# Altium schematic sheet ADC_DAC.SchDoc
size A3; DocumentNumber: 6; SheetNumber: 5; SheetTotal: 6
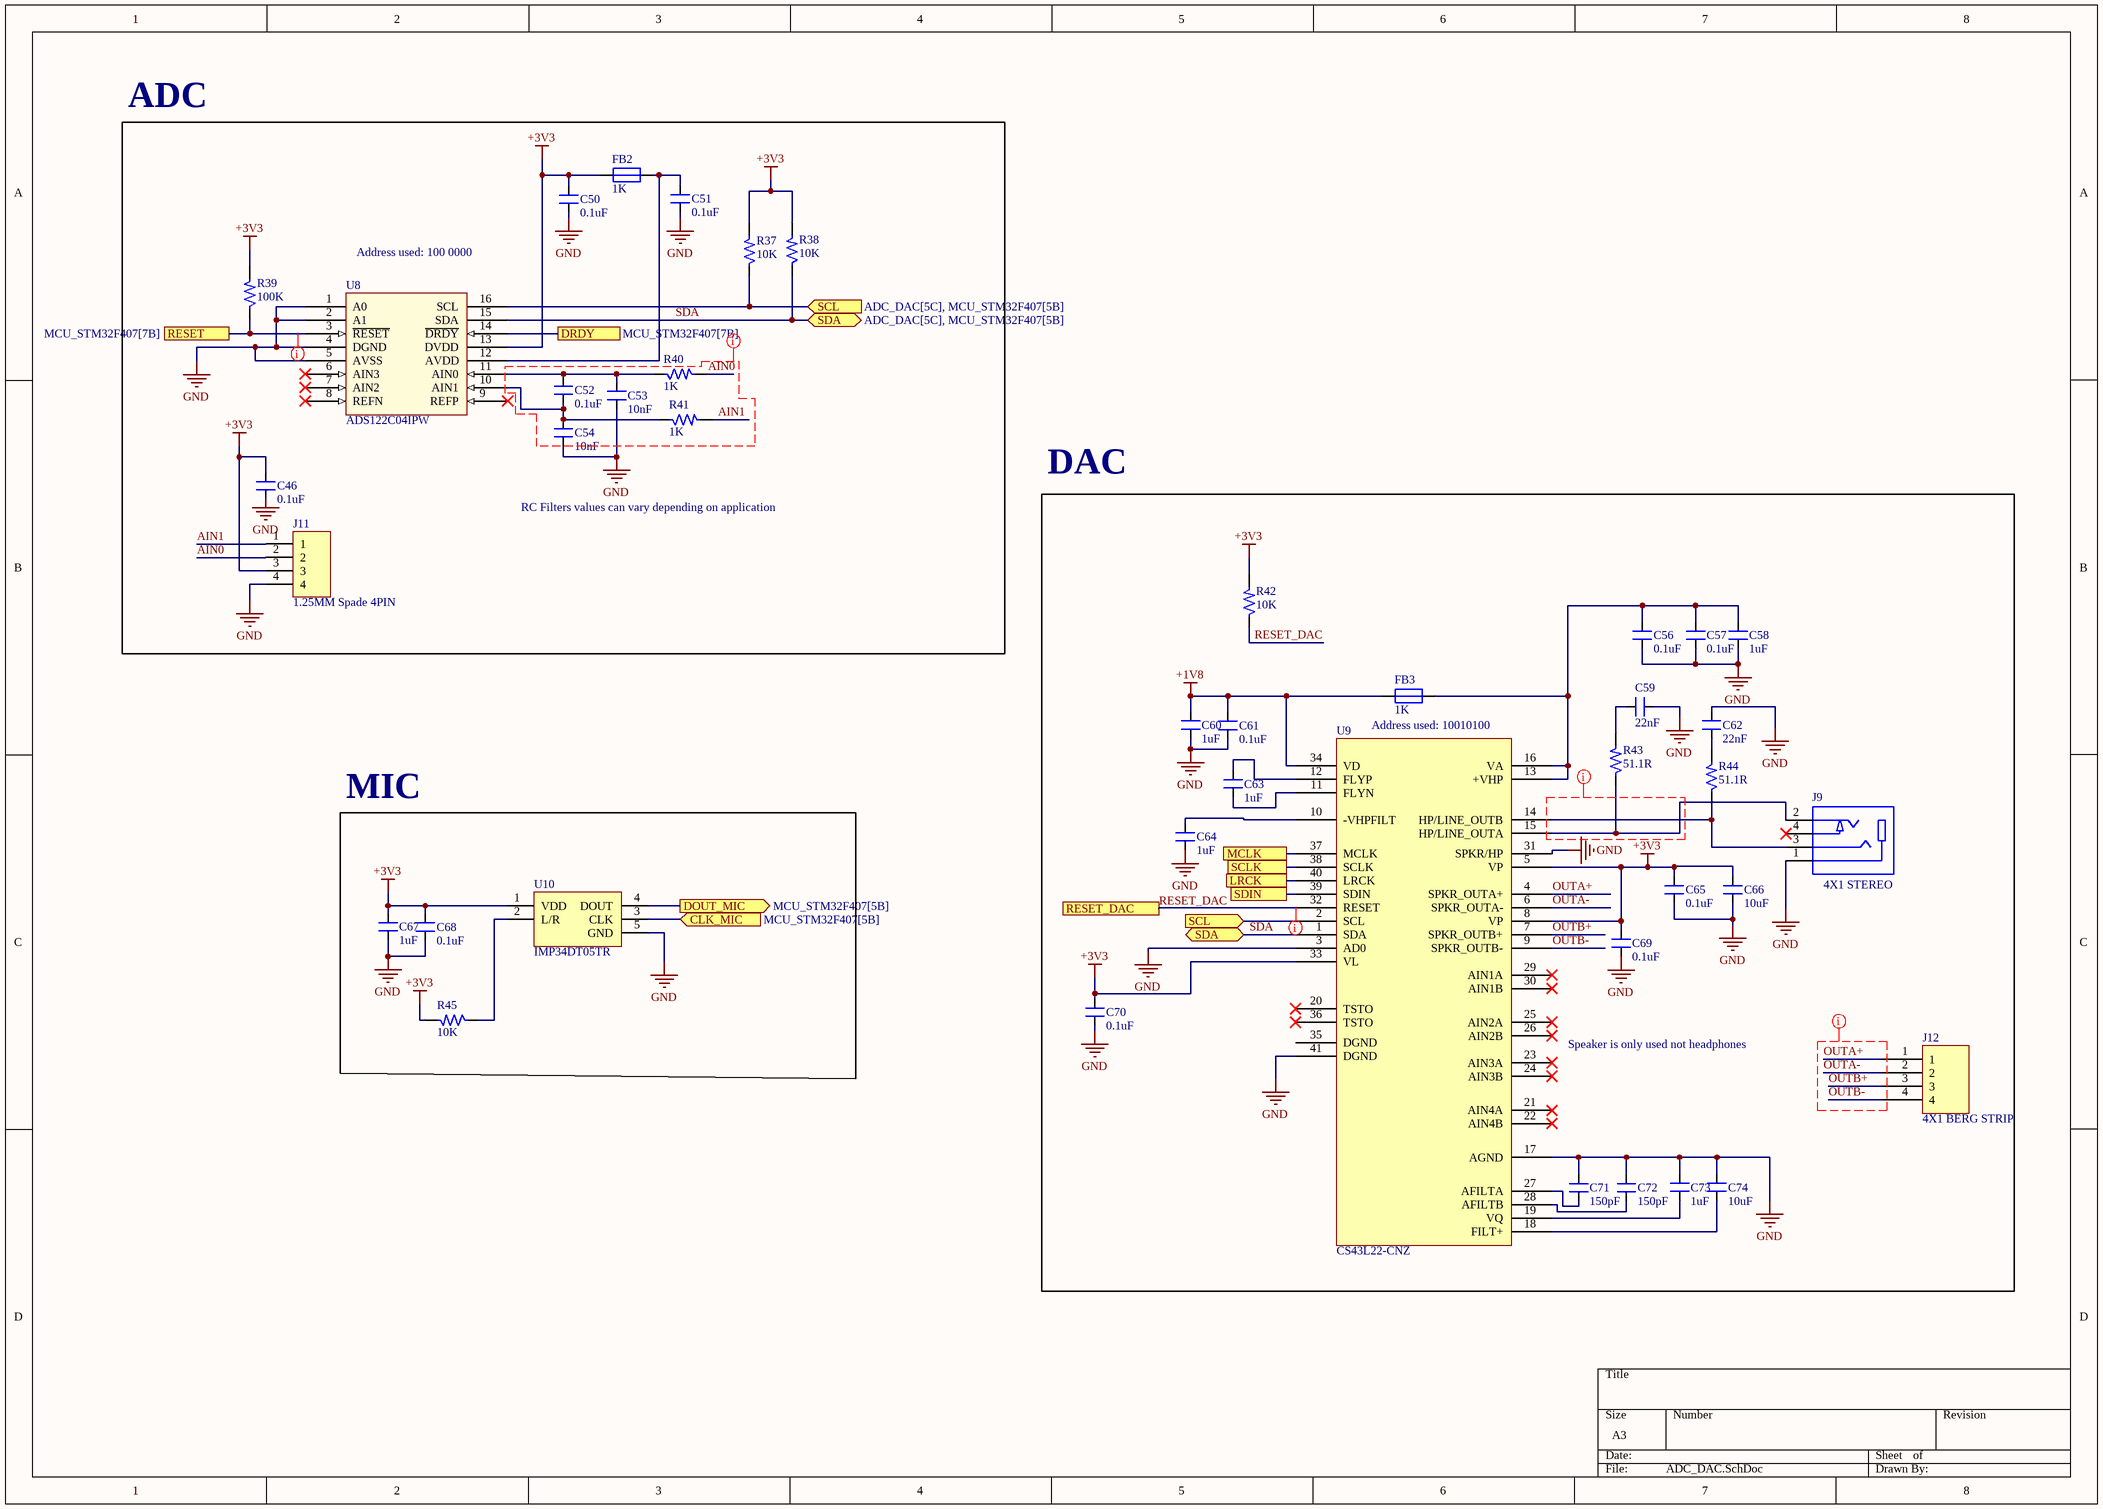
[diagram p0: ADC_DAC.SchDoc]

## Parts
C46  0.1uF  [CAP_0805]
C50  0.1uF  [CAP_0805]
C51  0.1uF  [CAP_0805]
C52  0.1uF  [CAP_0805]
C53  10nF  [CAP_0805]
C54  10nF  [CAP_0805]
C56  0.1uF  [CAP_0805]
C57  0.1uF  [CAP_0805]
C58  1uF  [CAP_0805]
C59  22nF  [CAP_0805]
C60  1uF  [CAP_0805]
C61  0.1uF  [CAP_0805]
C62  22nF  [CAP_0805]
C63  1uF  [CAP_0805]
C64  1uF  [CAP_0805]
C65  0.1uF  [CAP_0805]
C66  10uF  [CAP_1206]
C67  1uF  [CAP_0805]
C68  0.1uF  [CAP_0805]
C69  0.1uF  [CAP_0805]
C70  0.1uF  [CAP_0805]
C71  150pF  [CAP_0805]
C72  150pF  [CAP_0805]
C73  1uF  [CAP_0805]
C74  10uF  [CAP_1206]
FB2  1K  [IND_0805]
FB3  1K  [IND_0805]
J9  4X1 STEREO  [CON_SJ-2504A-SMT-TR_SMD]
J11  1.25MM Spade 4PIN  [CON4_50_653004117322_TH_RA]
J12  4X1 BERG STRIP  [CON4_100_40D72_TH_ST_MALE]
R37  10K  [RES_0603]
R38  10K  [RES_0603]
R39  100K  [RES_0603]
R40  1K  [RES_0603]
R41  1K  [RES_0603]
R42  10K  [RES_0603]
R43  51.1R  [RES_0603]
R44  51.1R  [RES_0603]
R45  10K  [RES_0603]
U8  ADS122C04IPW  [TSSOP16_25-59_294_54X14_SMT]
U9  CS43L22-CNZ  [QFN40_19_284_33X9_SMD]
U10  IMP34DT05TR  [HCLGA-4_53_137_15X37_SMD]

## Blocks framed on the sheet
ADC: C46 C50-C54 FB2 J11 R37-R41 U8
DAC: C56-C66 C69-C74 FB3 J9 J12 R42-R44 U9

## Ports
CLK_MIC (in, see MCU_STM32F407[5B]), DOUT_MIC (out, see MCU_STM32F407[5B]), DRDY (see MCU_STM32F407[7B]), LRCK (see MCU_STM32F407[5B]), MCLK, RESET (see MCU_STM32F407[7B]), RESET_DAC (see MCU_STM32F407[5B]), SCL (in, see ADC_DAC[4A], MCU_STM32F407[5B]), SCL (in, see ADC_DAC[5C], MCU_STM32F407[5B]), SCLK (see MCU_STM32F407[5B]), SDA (bidir, see ADC_DAC[4A], MCU_STM32F407[5B]), SDA (bidir, see ADC_DAC[5C], MCU_STM32F407[5B]), SDIN (see MCU_STM32F407[5B])

## Nets
+1V8: C60.2 C61.2 FB3.1 U9.34(VD)
+3V3: C46.2 C50.2 C65.2 C66.2 C67.2 C68.2 C69.2 C70.2 FB2.1 J11.3 R37.2 R38.2 R39.2 R42.2 R45.2 U8.13(DVDD) U9.5(VP) U9.8(VP) U9.33(VL) U10.1(VDD)
GND: C46.1 C50.1 C51.1 C53.2 C54.2 C56.1 C57.1 C58.1 C59.1 C60.1 C61.1 C62.2 C64.1 C65.1 C66.1 C67.1 C68.1 C69.1 C70.1 C71.2 C72.2 C73.2 C74.2 J9.1 J11.4 U8.1(A0) U8.2(A1) U8.4(DGND) U8.5(AVSS) U9.3(AD0) U9.17(AGND) U9.31(SPKR/HP) U9.41(DGND) U10.5(GND)
AIN0: J11.2 R40.2
AIN1: J11.1 R41.2
CLK_MIC: U10.3(CLK) ; port CLK_MIC
DOUT_MIC: U10.4(DOUT) ; port DOUT_MIC
DRDY: U8.14(~{DRDY}) ; port DRDY
LRCK: U9.40(LRCK) ; port LRCK
MCLK: U9.37(MCLK) ; port MCLK
OUTA+: J12.1 U9.4(SPKR_OUTA+)
OUTA-: J12.2 U9.6(SPKR_OUTA-)
OUTB+: J12.3 U9.7(SPKR_OUTB+)
OUTB-: J12.4 U9.9(SPKR_OUTB-)
RESET: R39.1 U8.3(~{RESET}) ; port RESET
RESET_DAC: R42.1 U9.32(RESET) ; port RESET_DAC
SCL: R37.1 U8.16(SCL) U9.2(SCL) ; port SCL
SCLK: U9.38(SCLK) ; port SCLK
SDA: R38.1 U8.15(SDA) U9.1(SDA) ; port SDA
SDIN: U9.39(SDIN) ; port SDIN
NetC51_2: C51.2 FB2.2 U8.12(AVDD)
NetC52_1: C52.1 C54.1 R41.1 U8.10(AIN1)
NetC52_2: C52.2 C53.1 R40.1 U8.11(AIN0)
NetC56_2: C56.2 C57.2 C58.2 FB3.2 U9.13(+VHP) U9.16(VA)
NetC59_2: C59.2 R43.2
NetC62_1: C62.1 R44.2
NetC63_1: C63.1 U9.11(FLYN)
NetC63_2: C63.2 U9.12(FLYP)
NetC64_2: C64.2 U9.10(-VHPFILT)
NetC71_1: C71.1 U9.27(AFILTA)
NetC72_1: C72.1 U9.28(AFILTB)
NetC73_1: C73.1 U9.19(VQ)
NetC74_1: C74.1 U9.18(FILT+)
NetJ9_2: J9.2 J9.3 R43.1 R44.1 U9.14(HP/LINE_OUTB) U9.15(HP/LINE_OUTA)
NetR45_1: R45.1 U10.2(L/R)

Not connected (* = marked no-connect by the designer): J9 4*; U8 6(AIN3)* 7(AIN2)* 8(REFN)* 9(REFP)*; U9 20(TSTO)* 21(AIN4A) 22(AIN4B)* 23(AIN3A)* 24(AIN3B)* 25(AIN2A)* 26(AIN2B)* 29(AIN1A)* 30(AIN1B)* 35(DGND) 36(TSTO)*

## Layout directives
net class Critical Nets: (no net found under the mark), AIN0, AIN1, OUTA+, OUTA-, OUTB+, OUTB-, RESET, RESET_DAC

## Notes on the sheet
- (near U8) Address used: 100 0000
- RC Filters values can vary depending on application
- Address used: 10010100
- MIC
- Speaker is only used not headphones

## Library data of the parts
C46 C50 C51 C56 C57 C61 C65 C68-C70 = CAP_0.1uF-50V-10%-0805: 0.1µF ±10% 50V Ceramic Capacitor X7R 0805 (2012 Metric); Manufacturer: Samsung; Manufacturer Part Number: CL21B104KBCNNNC; Alternate Part Number-1: NA; Case/Package: 0805; Supplier-1: SIRICOM; Supplier Part Number-1: 0805B104K500CT
C52 = CAP_0.1uF-50V-20%-0805: 0.1µF ±20% 50V Ceramic Capacitor X7R 0805 (2012 Metric); Manufacturer: Samsung Electro-Mechanics; Manufacturer Part Number: CL21B104MBCNNNC; Alternate Part Number-1: NA; Case/Package: 0805; Supplier-1: SIRICOM; Supplier Part Number-1: 0805B104K500CT
C53 C54 = CAP_10nF-50V-10%-0805: 10000pF ±10% 50V Ceramic Capacitor X7R 0805 (2012 Metric); Manufacturer: Samsung; Manufacturer Part Number: C0805C103K5RECAUTO; Alternate Part Number-1: GRM2195C1H103JA01D; Case/Package: 0805; Supplier-1: SIRICOM; Supplier Part Number-1: 0805B103K500CT
C58 C60 C63 C64 C67 C73 = CAP_1uF-50V-5%-0805: 1µF ±5% 50V Ceramic Capacitor X7R 0805 (2012 Metric); Manufacturer: Samsung; Manufacturer Part Number: CC0805JKX7R9BB105; Alternate Part Number-1: 0805F105M500NT; Case/Package: 0805; Supplier-1: SIRICOM; Supplier Part Number-1: CL21B105KBFNNNE
C59 C62 = CAP_22nF-50V-10%-0805: 0.022µF ±10% 50V Ceramic Capacitor X7R 0805 (2012 Metric); Manufacturer: Samsung Electro-Mechanics; Manufacturer Part Number: CL21B223KBANNNC; Alternate Part Number-1: NA; Case/Package: 0805; Supplier-1: Digikey; Supplier Part Number-1: 1276-1081-1-ND - Cut Tape (CT)
C66 C74 = CAP_10uF-50V-10%-1206: 10µF ±10% 50V Ceramic Capacitor X7R 1206 (3216 Metric); Manufacturer: KEMET; Manufacturer Part Number: CL31B106KBHNNNE; Alternate Part Number-1: GRT31CR61H106ME01L; Case/Package: 1206; Supplier-1: SIRICOM; Supplier Part Number-1: CC1206KKX5R9BB106
C71 C72 = CAP_150pF-50V-10%-0805: 150pF ±10% 50V Ceramic Capacitor C0G, NP0 0805 (2012 Metric); Manufacturer: AVX Corporation; Manufacturer Part Number: 08055A151KAT2A; Alternate Part Number-1: NA; Case/Package: 0805; Supplier-1: Digikey; Supplier Part Number-1: 478-10501-1-ND - Cut Tape (CT)
FB2 FB3 = FB_1K-100MHZ-1.6A-0805: 1 kOhms @ 100MHz 1 Power Line Ferrite Bead 0805 (2012 Metric) 1.6A; Manufacturer: Laird; Manufacturer Part Number: BLM21SP102SH1D; Alternate Part Number-1: NA; Case/Package: 0805; Supplier-1: SIRICOM; Supplier Part Number-1: ACMS201209A102
J9 = CON-PLG-STEREO_4X1-100-RA-SMD: 2.50mm (0.094", 3/32", Sub Mini, Miniature) - Headphone Phone Jack Stereo (4 Conductor, TRRS) Connector Solder; Manufacturer: CUI Devices; Manufacturer Part Number: SJ-2504A-SMT-TR; Alternate Part Number-1: NA; Case/Package: SMD; Supplier Part Number-1: CP-SJ-2504A-SMT-CT-ND - Cut Tape (CT); Supplier-1: Digikey
J11 = CON-PLG_4X1-50-RA-TH: 4 Pins, 1 Row 1.25mm Pitch, right angle Connector, male; Manufacturer Part Number: 653004117322; Manufacturer: JST; Mating Part Number: 653004113322; Crimp Part Number: 653153128130; Alternate Part Number-1: NA; Case/Package: TH-CON; Supplier-1: WURTH; Supplier Part Number-1: 653004117322
J12 = CON-BS-PLG_4X1-100-ST-TH: 4 Pins, 1 Row 2.54mm Pitch, Straight bergstrip, Male; Manufacturer: NA; Manufacturer Part Number: NA; Case/Package: TH-CON; Supplier-1: SP ROAD; Supplier Part Number-1: NA; Alternate Part Number-1: NA
R37 R38 R42 R45 = RES_10K-0.1W-1%-0603: 10 kOhms ±1% 0.1W, 1/10W Chip Resistor 0603 (1608 Metric) Automotive AEC-Q200 Thick Film; Manufacturer: Walsin; Manufacturer Part Number: WR06X1002FTL; Alternate Part Number-1: 0603WAJ0103T5E; Case/Package: 0603; Supplier-1: SIRICOM; Supplier Part Number-1: WR06X1002FTL
R39 = RES_100K-0.1W-1%-0603: 100 kOhms ±1% 0.1W, 1/10W Chip Resistor 0603 (1608 Metric) Automotive AEC-Q200 Thick Film; Manufacturer: Stackpole Electronics; Manufacturer Part Number: RMCF0603FT100K; Alternate Part Number-1: NA; Case/Package: 0603; Supplier-1: Arrow; Supplier Part Number-1: RMCF0603FT100K
R40 R41 = RES_1K-0.1W-1%-0603: 1 kOhms ±1% 0.1W, 1/10W Chip Resistor 0603 (1608 Metric) Automotive AEC-Q200 Thick Film; Manufacturer: Walsin; Manufacturer Part Number: WR06X1001FTL; Alternate Part Number-1: 0603WAF1001T5E; Case/Package: 0603; Supplier-1: SIRICOM; Supplier Part Number-1: WR06X1001FTL
R43 R44 = RES_51.1R-0.1W-1%-0603: 51.1 Ohms ±1% 0.1W, 1/10W Chip Resistor 0603 (1608 Metric) Thick Film; Manufacturer: Vishay Dale; Manufacturer Part Number: CRCW060351R1FKEAC; Alternate Part Number-1: NA; Case/Package: 0603; Supplier-1: Digikey; Supplier Part Number-1: 541-5468-1-ND - Cut Tape (CT)
U8 = IC_ADS122C04IPW: 24 Bit Analog to Digital Converter 4 Input 1 Sigma-Delta 16-TSSOP; Manufacturer: Texas Instruments; Alternate Part Number-1: NA; Manufacturer Part Number: ADS122C04IPW; Case/Package: TSSOP16; Supplier-1: MOUSER; Supplier Part Number-1: ADS122C04IPW
U9 = IC_CS43L22: Audio D/A Converter ICs Low Power Stereo DAC w/ClassD Spkr Driver; Manufacturer: Cirrus Logic; Alternate Part Number-1: NA; Manufacturer Part Number: CS43L22-CNZ; Case/Package: QFN-40; Supplier-1: Mouser; Supplier Part Number-1: 777-CS43L22-CNZ
U10 = IC_IMP34DT05TR: MEMS Microphones AUTO & INDUSTRIAL SENSORS; Manufacturer: STMicroelectronics; Alternate Part Number-1: NA; Manufacturer Part Number: IMP34DT05TR; Case/Package: HCLGA-4; Supplier-1: Mouser; Supplier Part Number-1: 511-IMP34DT05TR